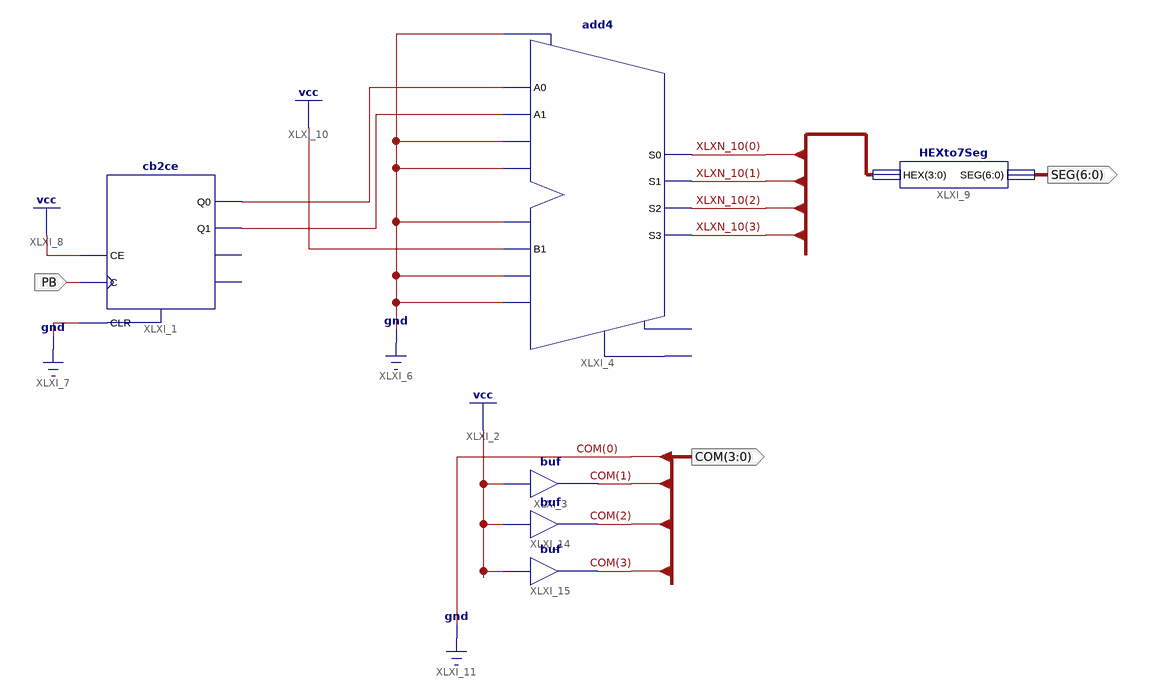
[diagram p0: schematic sheet 1]
// Xilinx ISE schematic main.sch (spartan6) as structural Verilog: 6 symbols, 3 ports
module main (
  input  PB,
  output [6:0] SEG,
  output [3:0] COM
);

  wire XLXN_2, XLXN_3;
  wire [3:0] XLXN_10;

  cb2ce XLXI_1 (.C(PB), .CE(1'b1), .CLR(1'b0), .Q0(XLXN_2), .Q1(XLXN_3));  // open: CEO, TC
  add4 XLXI_4 (
    .A0(XLXN_2), .A1(XLXN_3), .A2(1'b0), .A3(1'b0), .B0(1'b0), .B1(1'b1), .B2(1'b0), .B3(1'b0), .CI(1'b0),
    .S0(XLXN_10[0]), .S1(XLXN_10[1]), .S2(XLXN_10[2]), .S3(XLXN_10[3]));  // open: CO, OFL
  HEXto7Seg XLXI_9 (.HEX(XLXN_10), .SEG(SEG));
  buf XLXI_3 (COM[1], 1'b1);
  buf XLXI_14 (COM[2], 1'b1);
  buf XLXI_15 (COM[3], 1'b1);

  assign COM[0] = 1'b0;
endmodule
